# EAGLE design 2xSplitter (EAGLE 8.7.1)
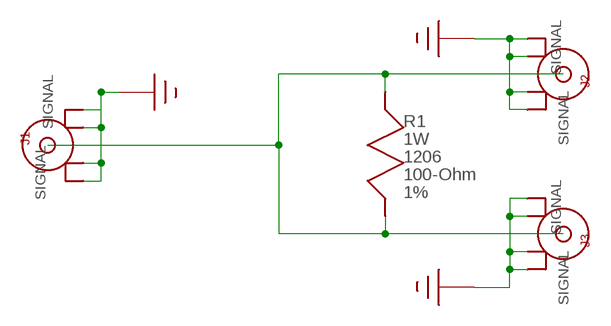
[diagram p0: schematic, sheet 1]

## Parts
J1  SMA-END  [SMA-END]
J2  SMA-END  [SMA-END]
J3  SMA-END  [SMA-END]
R1  100-Ohm  RESISTOR-R1206  [R1206]

## Nets
GROUND: J1.P$2 J1.P$3 J1.P$4 J1.P$5 J2.P$2 J2.P$3 J2.P$4 J2.P$5 J3.P$2 J3.P$3 J3.P$4 J3.P$5
N$1: J1.SIGNAL J2.SIGNAL J3.SIGNAL R1.P$1(A) R1.P$2(B)

## Library data of the parts
J1-J3 = lib:SMA-END; PARTNUM: ACX1911-ND
R1 = lib:RESISTOR; POWER: 1W; SIZE: 1206; TOLERANCE: 1%

## Board
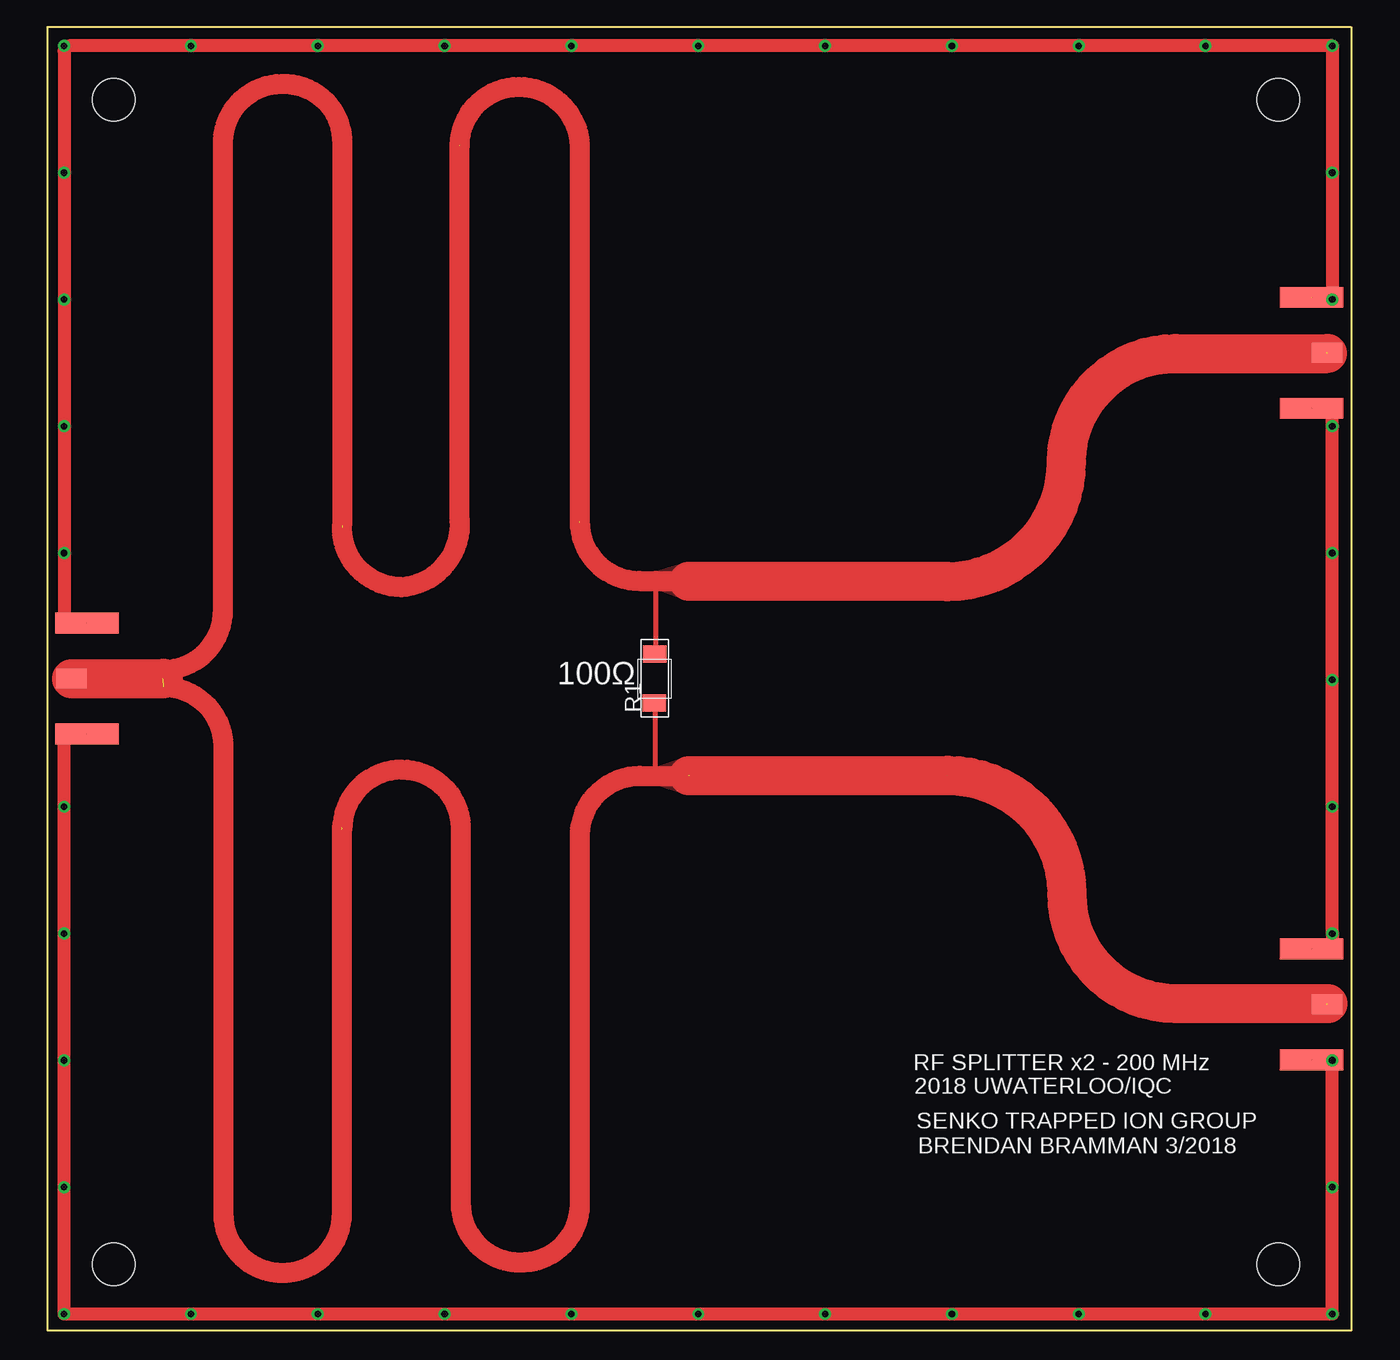
[diagram p1: board, top side]
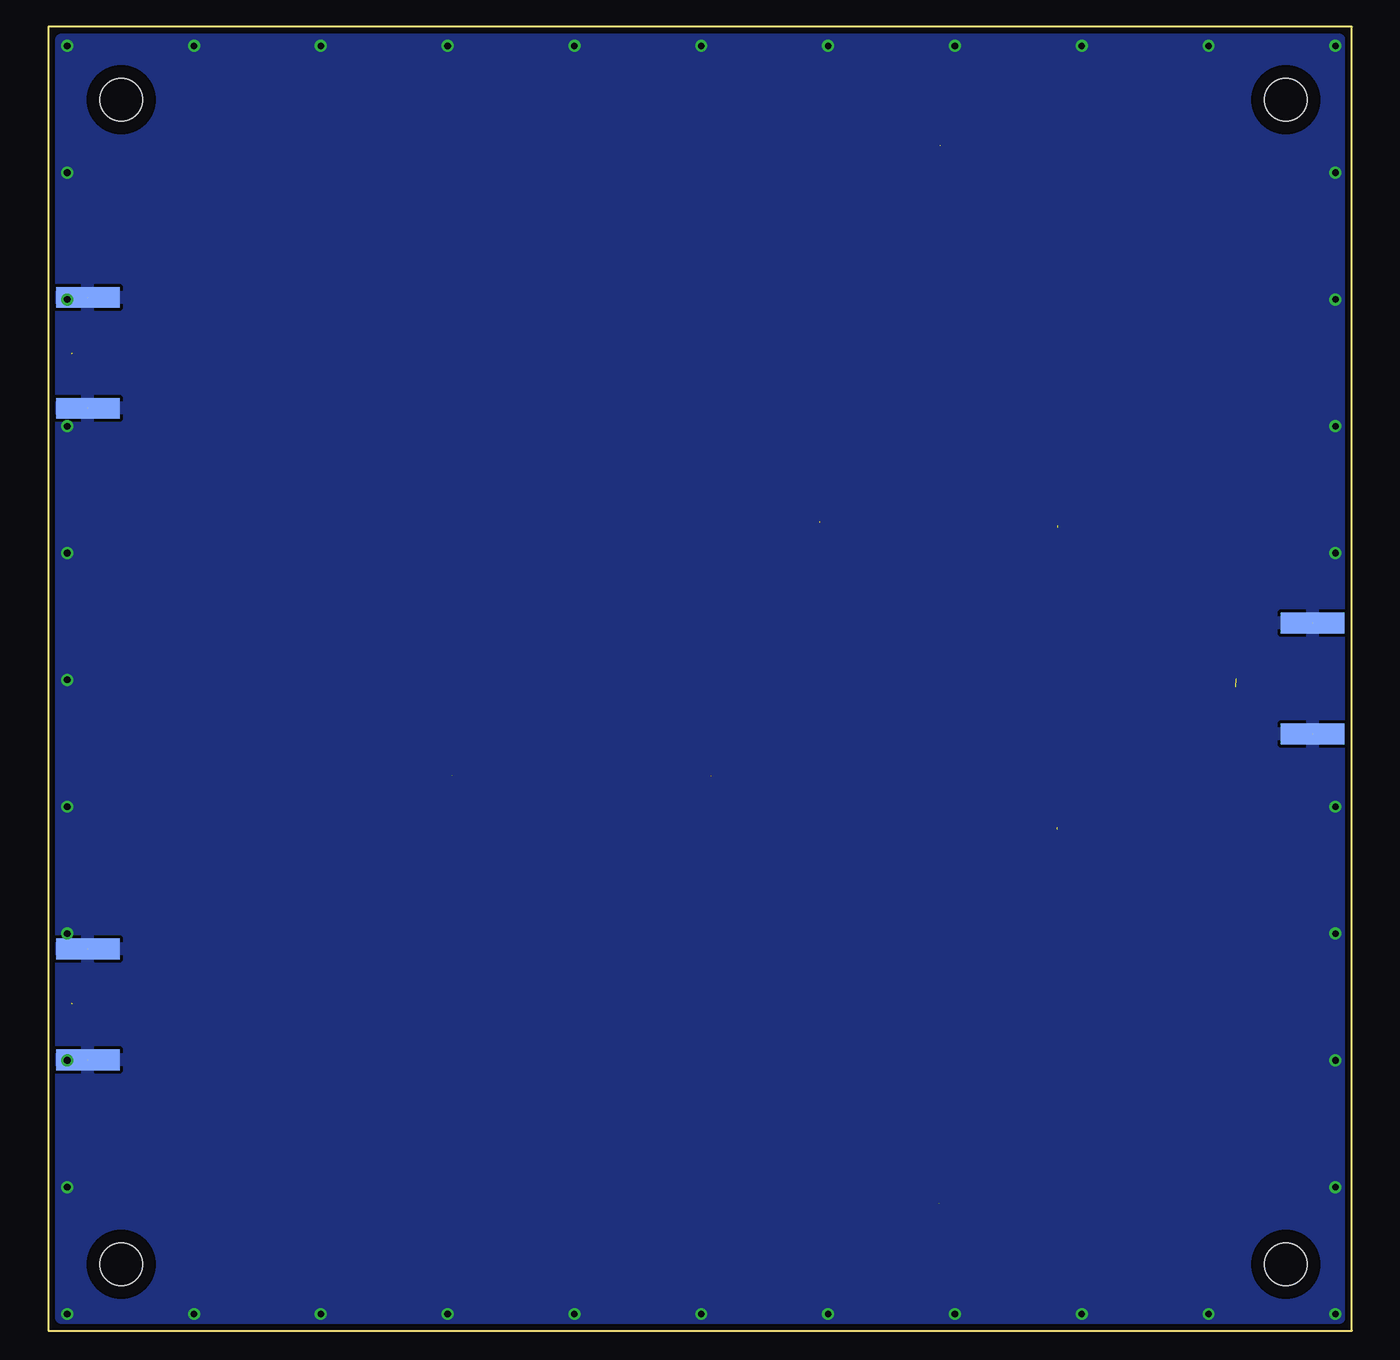
[diagram p2: board, bottom side, seen from below]

No outline drawn. Coordinates in mm, seen from the top.
Copper layers (1*16): Top 0.035mm / dielectric 1.5mm / Bottom 0.035mm
Design rules "default": minimum track width 6mil, minimum drill 0.35mm, track to track 6mil, track to pad 6mil, pad to pad 6mil, via to via 6mil, smd to smd 6mil, copper to edge 40mil, drill to drill 6mil, minimum pad ring 10mil, minimum via ring 8mil, stop-mask expansion 4mil, vias tented up to drill 0mil, thermal gap 10mil
Holes 3.26 mm at 5.08,5.08 94.41,5.08 94.41,94.41 5.08,94.41
Milling: 4 lines

### Footprints (pad centres in the part's own frame; a part is rotated, then mirrored left to right if it is on the bottom)
SMA-END = smd 1.6 x 4.902 bottom: P$2 -4.255,3.039; P$3 4.255,3.039 | smd 1.6 x 4.902: P$4 4.255,3.039; P$5 -4.255,3.039 | smd 1.499 x 2.362: SIGNAL 0,1.854
R1206 = smd 1.295 x 1.803: P$1 -1.854,0.025; P$2 1.88,0

### Placement (x,y rotation side)
J1  -0.02,50.02 270 top
J2  100,75 90 top
J3  100,25.03 90 top
R1  46.57,50.01 90 top

### Tracks (layer width: path | path; a pad name or v marks a point on that pad's centre or on a via)
GROUND  (via drill 0.51)  (6 unrouted)
  Top 0.254: v1.27,98.55 1.27,98.17 1.65,98.55 | 1.27,54.36 1.22,54.3 | 1.27,45.44 1.35,45.52 | 98.55,70.28 98.63,70.36
  Top 1.016: 1.27,98.17 1.27,54.36 | 1.27,45.44 v1.27,1.27 v98.55,1.27 v98.55,20.73 | v98.55,30.45 v98.55,69.37 98.55,70.28 | v98.55,79.1 v98.55,98.55 1.65,98.55
  other vias: 1.27,88.82 98.55,49.91 1.27,79.1 1.27,69.37 1.27,59.64 1.27,40.18 1.27,30.45 1.27,20.73 1.27,11 11,1.27 20.73,1.27 30.45,1.27 40.18,1.27 49.91,1.27 59.64,1.27 69.37,1.27 79.1,1.27 88.82,1.27 98.55,11 98.55,40.18 98.55,59.64 98.55,88.82 88.82,98.55 79.1,98.55 69.37,98.55 59.64,98.55 49.91,98.55 40.18,98.55 30.45,98.55 20.73,98.55 11,98.55
  pour Bottom: 1,1 1,99 99,99 99,1
N$1  (10 unrouted)
  Top 0.381: 46.63,51.96 arc-90 R1.P$2 arc90 46.66,51.98 46.66,57.51 | 46.51,48.12 arc-90 R1.P$1 arc-90 46.58,48.11 46.58,42.55
  Top 1.537: 8.87,50.02 8.87,50.68 arc90 13.46,55.27 13.46,91.11 arc-90 17.98,95.63 | 17.98,95.63 18.06,95.63 | 17.98,95.63 arc-90 22.58,91.36 22.58,61.75 | 22.58,61.59 arc90 27.15,57.02 arc90 31.62,62.2 31.62,90.93 | 31.62,90.88 arc-90 36.14,95.4 arc-90 40.82,90.75 40.82,61.98 | 40.82,62.08 arc90 45.39,57.51 46.66,57.51 49.15,57.51 arc-90 49.17,57.48 | 8.9,49.37 arc-90 13.49,44.78 13.49,8.94 arc90 18.01,4.42 arc90 22.58,8.99 22.58,38.61 | 22.61,38.46 arc-90 27.18,43.03 arc-90 31.7,38.51 31.7,9.78 | 31.7,9.75 arc90 36.22,5.23 arc90 40.84,9.6 40.84,37.97 arc-90 45.41,42.55 46.58,42.55 49.17,42.55
  Top 2.985: J1.SIGNAL 8.87,50.02 8.9,50.05 | 49.17,57.48 68.99,57.48 arc-90 69.01,57.45 arc90 78.16,66.6 arc-90 86.51,74.95 98.2,74.95 | 49.2,42.57 69.01,42.57 | 69.04,42.6 arc-90 78.18,33.45 arc90 86.54,25.09 98.22,25.09
  pour Top: 46.53,58.14 49.05,58.9 49.05,56.06 46.53,56.97 46.56,58.12
  pour Top: 46.48,43.13 48.97,43.97 48.97,41.17 46.56,41.94
N$2
  Top 1.016: 98.55,30.43 98.55,29.62 98.53,29.59

### Text on the board
tPlace: 100Ω | RF SPLITTER x2 - 200 MHz | 2018 UWATERLOO/IQC | SENKO TRAPPED ION GROUP | BRENDAN BRAMMAN 3/2018